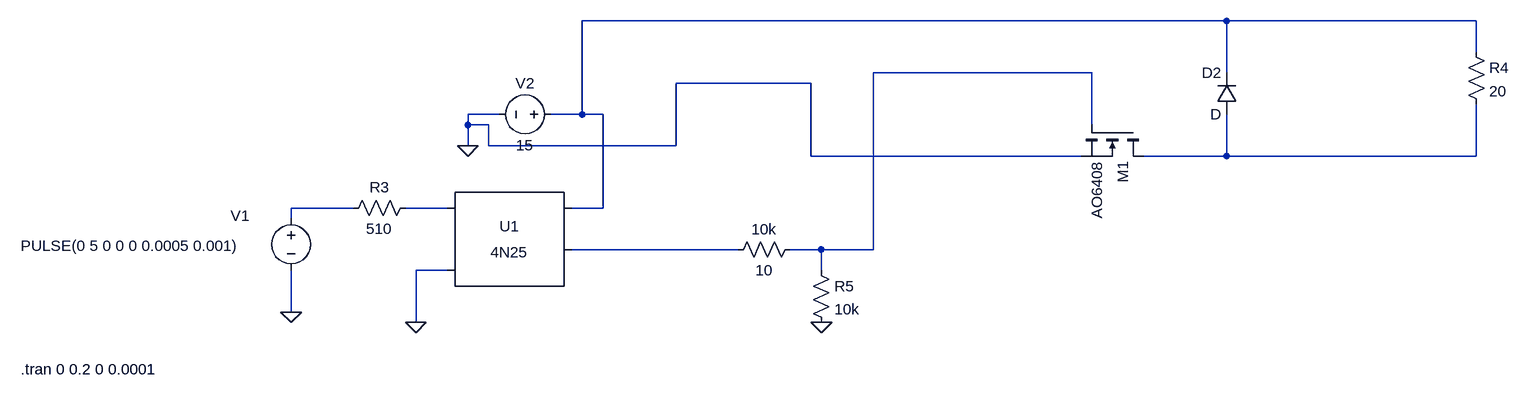
[diagram p0: schematic Gate_Driver.asc]
Gate_Driver.asc, the LTspice schematic file:
Version 4
SHEET 1 2204 680
WIRE 1424 -240 432 -240
WIRE 1808 -240 1424 -240
WIRE 1808 -192 1808 -240
WIRE 1216 -160 880 -160
WIRE 1424 -160 1424 -240
WIRE 784 -144 576 -144
WIRE 304 -96 256 -96
WIRE 432 -96 432 -240
WIRE 432 -96 384 -96
WIRE 464 -96 432 -96
WIRE 256 -80 256 -96
WIRE 288 -80 256 -80
WIRE 1216 -80 1216 -160
WIRE 256 -48 256 -80
WIRE 288 -48 288 -80
WIRE 576 -48 576 -144
WIRE 576 -48 288 -48
WIRE 784 -32 784 -144
WIRE 1200 -32 784 -32
WIRE 1424 -32 1424 -96
WIRE 1424 -32 1296 -32
WIRE 1808 -32 1808 -112
WIRE 1808 -32 1424 -32
WIRE 80 48 -16 48
WIRE 224 48 160 48
WIRE 464 48 464 -96
WIRE 464 48 416 48
WIRE -16 64 -16 48
WIRE 672 112 416 112
WIRE 800 112 752 112
WIRE 880 112 880 -160
WIRE 880 112 800 112
WIRE 224 144 176 144
WIRE 800 144 800 112
WIRE -16 208 -16 144
WIRE 176 224 176 144
FLAG 176 224 0
FLAG 256 -48 0
FLAG -16 208 0
FLAG 800 224 0
SYMBOL Optos\\4N25 320 112 R0
SYMATTR InstName U1
SYMBOL voltage -16 48 R0
WINDOW 0 -93 12 Left 2
WINDOW 3 -416 58 Left 2
WINDOW 123 0 0 Left 0
WINDOW 39 0 0 Left 0
SYMATTR InstName V1
SYMATTR Value PULSE(0 5 0 0 0 0.0005 0.001)
SYMBOL voltage 400 -96 R90
WINDOW 0 -32 56 VBottom 2
WINDOW 3 32 56 VTop 2
WINDOW 123 0 0 Left 0
WINDOW 39 0 0 Left 0
SYMATTR InstName V2
SYMATTR Value 15
SYMBOL res 656 128 R270
WINDOW 0 32 56 VTop 2
WINDOW 3 0 56 VBottom 2
SYMATTR InstName 10k
SYMATTR Value 10
SYMBOL res 64 64 R270
WINDOW 0 32 56 VTop 2
WINDOW 3 0 56 VBottom 2
SYMATTR InstName R3
SYMATTR Value 510
SYMBOL res 1792 -208 R0
SYMATTR InstName R4
SYMATTR Value 20
SYMBOL res 784 128 R0
SYMATTR InstName R5
SYMATTR Value 10k
SYMBOL diode 1440 -96 R180
WINDOW 0 24 64 Left 2
WINDOW 3 24 0 Left 2
SYMATTR InstName D2
SYMBOL nmos 1296 -80 R90
SYMATTR InstName M1
SYMATTR Value AO6408
TEXT -432 296 Left 2 !.tran 0 0.2 0 0.0001

The netlist it stands for:
* Gate_Driver.asc
XU1 N005 0 N001 N006 NC_01 4N25
V1 N004 0 PULSE(0 5 0 0 0 0.0005 0.001)
V2 N001 0 15
R§10k N006 N002 10
R3 N004 N005 510
R4 N001 N003 20
R5 N002 0 10k
D2 N003 N001 D
M1 N003 N002 0 0 AO6408
.model D D
.lib standard.dio
.model NMOS NMOS
.model PMOS PMOS
.lib standard.mos
.tran 0 0.2 0 0.0001
.lib 4N25.sub
.backanno
.end